# EAGLE design IOB-I2C-MAX731x (EAGLE 7.7.0)
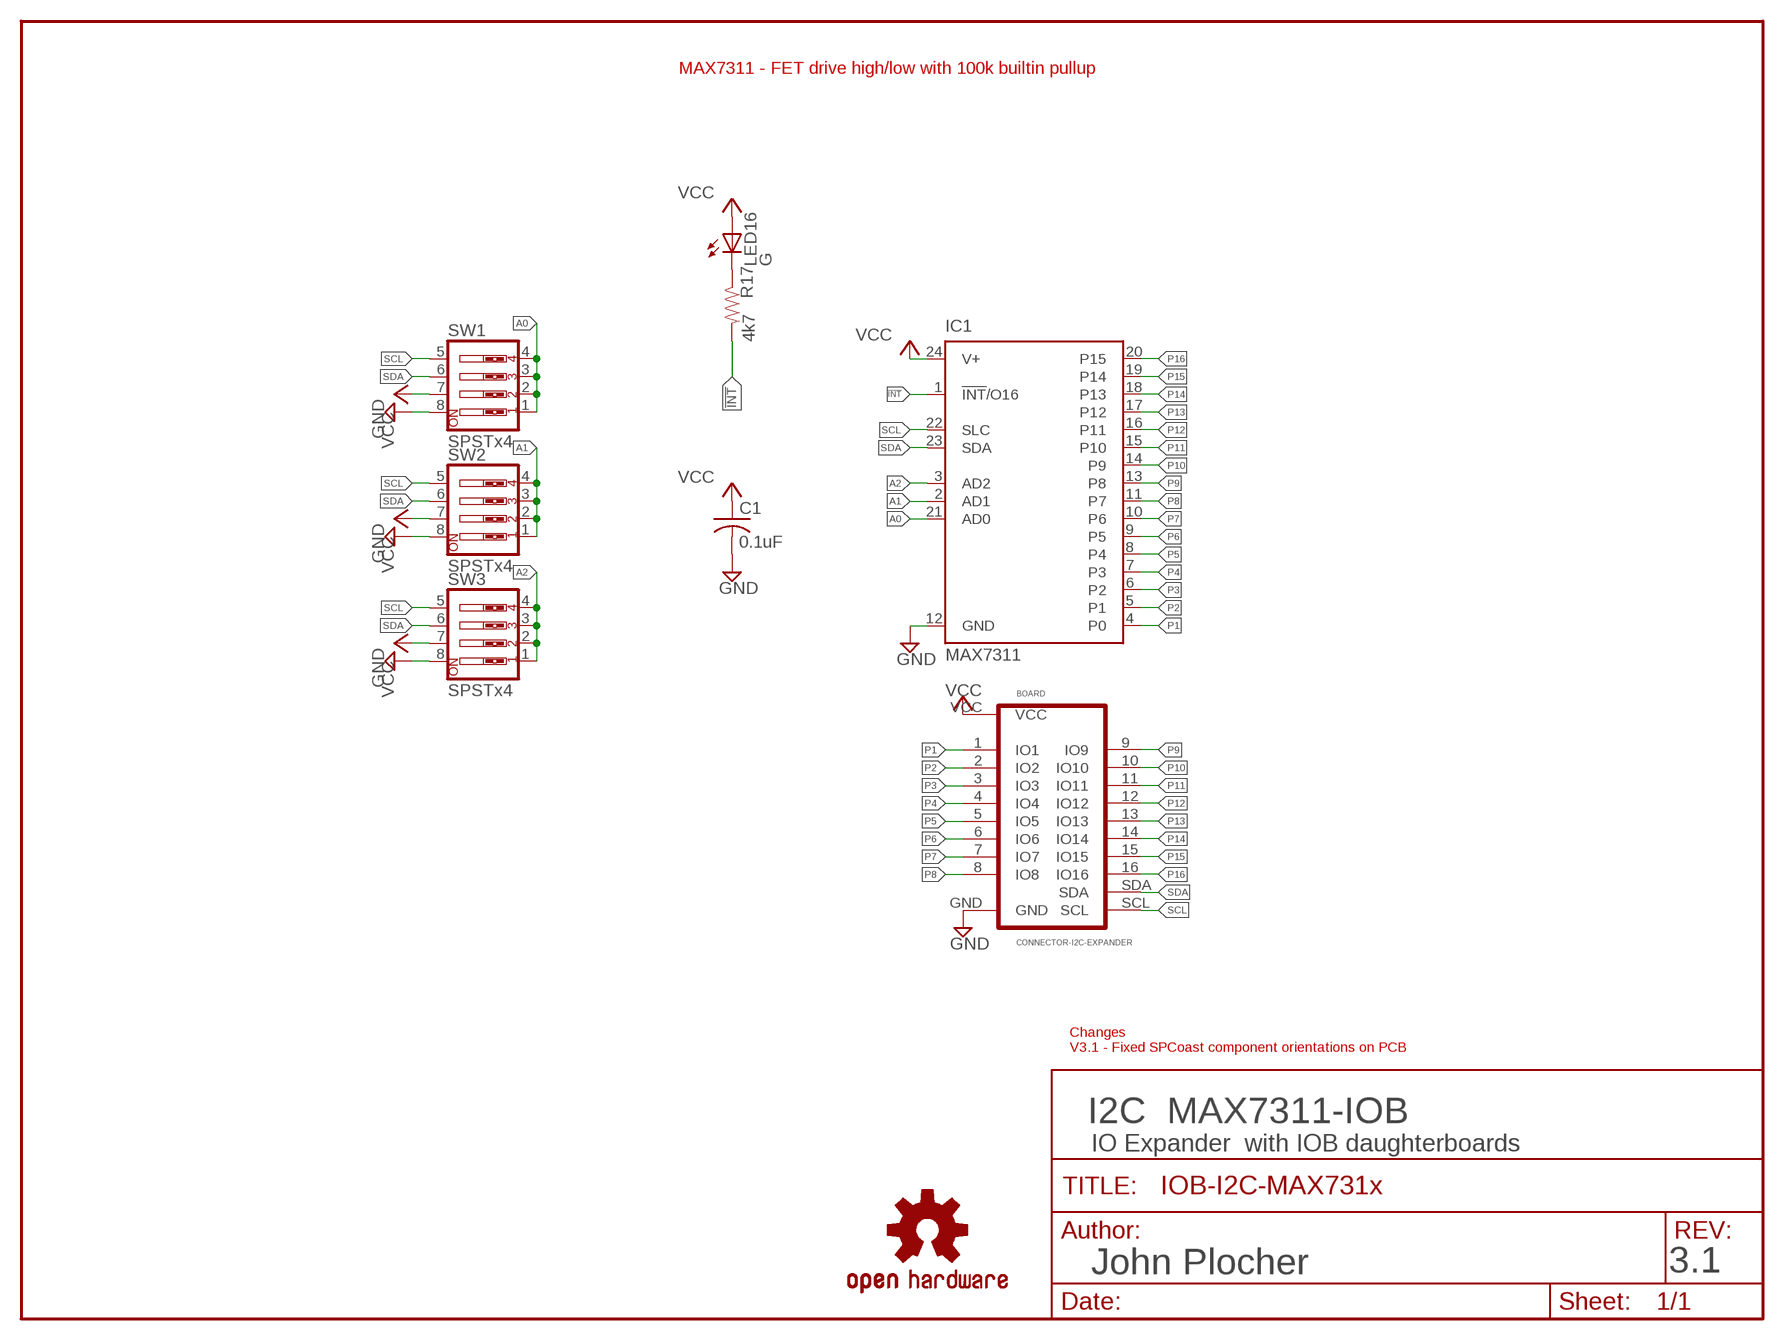
[diagram p0: schematic, sheet 1]

## Parts
BOARD  CONNECTOR-I2C-EXPANDER  [I2C-EXPANDER]
C1  0.1uF  CAP0603  [0603-CAP]
IC1  MAX7311  MAX73XX/AUG  [TSSOP24]
LED16  G  LED0603-LED  [0603-LED]
R17  4k7  R0603-RES  [0603-RES]
SW1  SPSTx4  SW_DIP-4  [EDG-04]
SW2  SPSTx4  SW_DIP-4  [EDG-04]
SW3  SPSTx4  SW_DIP-4  [EDG-04]
U$1  OSHW  DOC-OSHW-LOGO-L  [OSHW-LOGO-L]

## Nets
!INT [signals]: IC1.1(!INT!/O16) R17.2
A0 [signals]: IC1.21(AD0) SW1.1 SW1.2 SW1.3 SW1.4
A1 [signals]: IC1.2(AD1) SW2.1 SW2.2 SW2.3 SW2.4
A2 [signals]: IC1.3(AD2) SW3.1 SW3.2 SW3.3 SW3.4
GND [Power]: BOARD.GND C1.2 IC1.12(GND) SW1.8 SW2.8 SW3.8
N$38: LED16.C R17.1
P1 [signals]: BOARD.1(IO1) IC1.4(P0)
P2 [signals]: BOARD.2(IO2) IC1.5(P1)
P3 [signals]: BOARD.3(IO3) IC1.6(P2)
P4 [signals]: BOARD.4(IO4) IC1.7(P3)
P5 [signals]: BOARD.5(IO5) IC1.8(P4)
P6 [signals]: BOARD.6(IO6) IC1.9(P5)
P7 [signals]: BOARD.7(IO7) IC1.10(P6)
P8 [signals]: BOARD.8(IO8) IC1.11(P7)
P9 [signals]: BOARD.9(IO9) IC1.13(P8)
P10 [signals]: BOARD.10(IO10) IC1.14(P9)
P11 [signals]: BOARD.11(IO11) IC1.15(P10)
P12 [signals]: BOARD.12(IO12) IC1.16(P11)
P13 [signals]: BOARD.13(IO13) IC1.17(P12)
P14 [signals]: BOARD.14(IO14) IC1.18(P13)
P15 [signals]: BOARD.15(IO15) IC1.19(P14)
P16 [signals]: BOARD.16(IO16) IC1.20(P15)
SCL [signals]: BOARD.SCL IC1.22(SLC) SW1.5 SW2.5 SW3.5
SDA [signals]: BOARD.SDA IC1.23(SDA) SW1.6 SW2.6 SW3.6
VCC [Power]: BOARD.VCC C1.1 IC1.24(V+) LED16.A SW1.7 SW2.7 SW3.7

## Notes on the sheet
- MAX7311 - FET drive high/low with 100k builtin pullup
- Changes
  V3.1 - Fixed SPCoast component orientations on PCB
- I2C  MAX7311-IOB
- IO Expander  with IOB daughterboards
- John Plocher | 3.1

## Library data of the parts
BOARD = SPCoast:CONNECTOR-I2C-EXPANDER
C1 = SPCoast:CAP*
IC1 = SPCoast:MAX73XX: 16-Port I/O Expander with LED Intensity Control, Interrupt, and Hot-Insertion Protection
LED16 = SPCoast:LED*
R17 = SPCoast:R*: Resistor Basic schematic elements and footprints for 0603, 1206, and PTH 1/10th watt (small) resistors.
SW1-SW3 = SPCoast:SW_DIP-4: DIP SWITCH
U$1 = SPCoast:DOC-OSHW-LOGO-: Open Source Hardware Logo This logo indicates the piece of hardware it is found on incorporates a OSHW license and/or adheres to the definition of open source hardware http://freedomdefined.org/OSHW Creative Commons - Attribution - ShareAlike 3.0

## Net classes
0 default: width 0.254 mm, drill 0.4 mm, clearance 0.127 mm
1 Power: width 0.254 mm, drill 0.4 mm, clearance 0.127 mm
2 signals: width 0.254 mm, drill 0.4 mm, clearance 0.127 mm

## Board
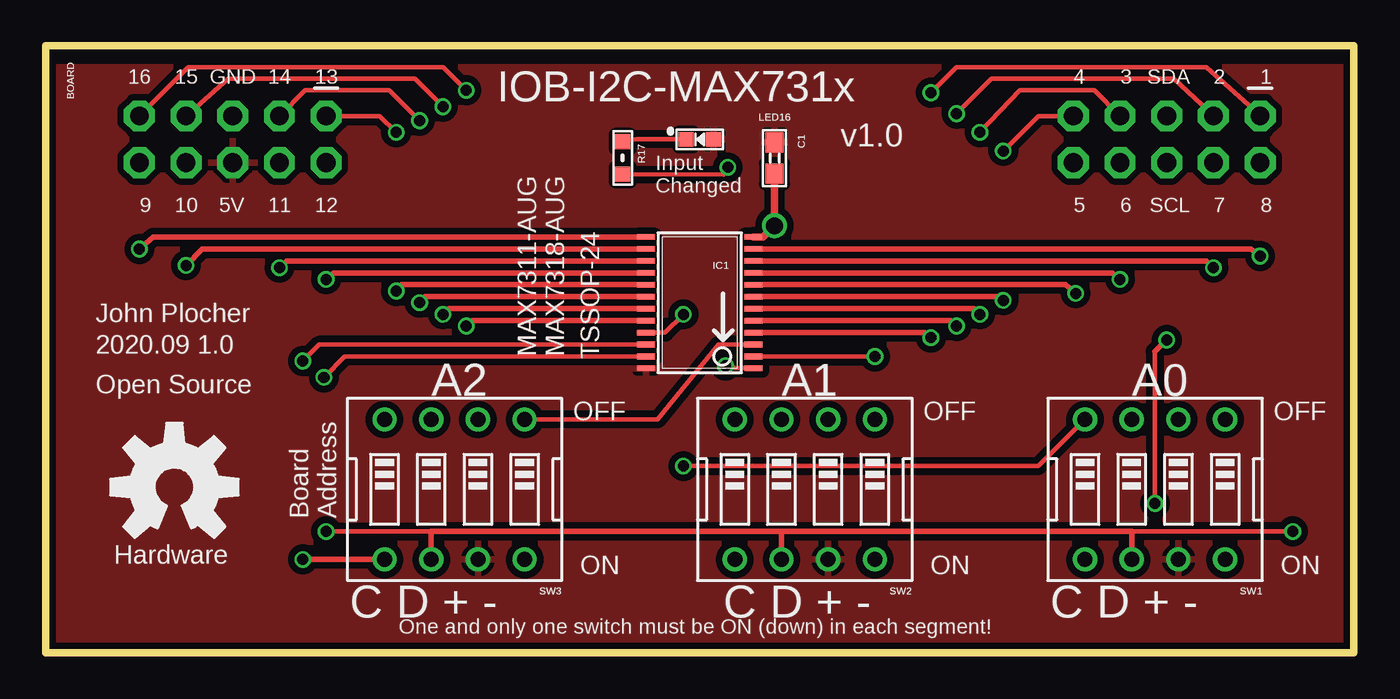
[diagram p1: board, top side]
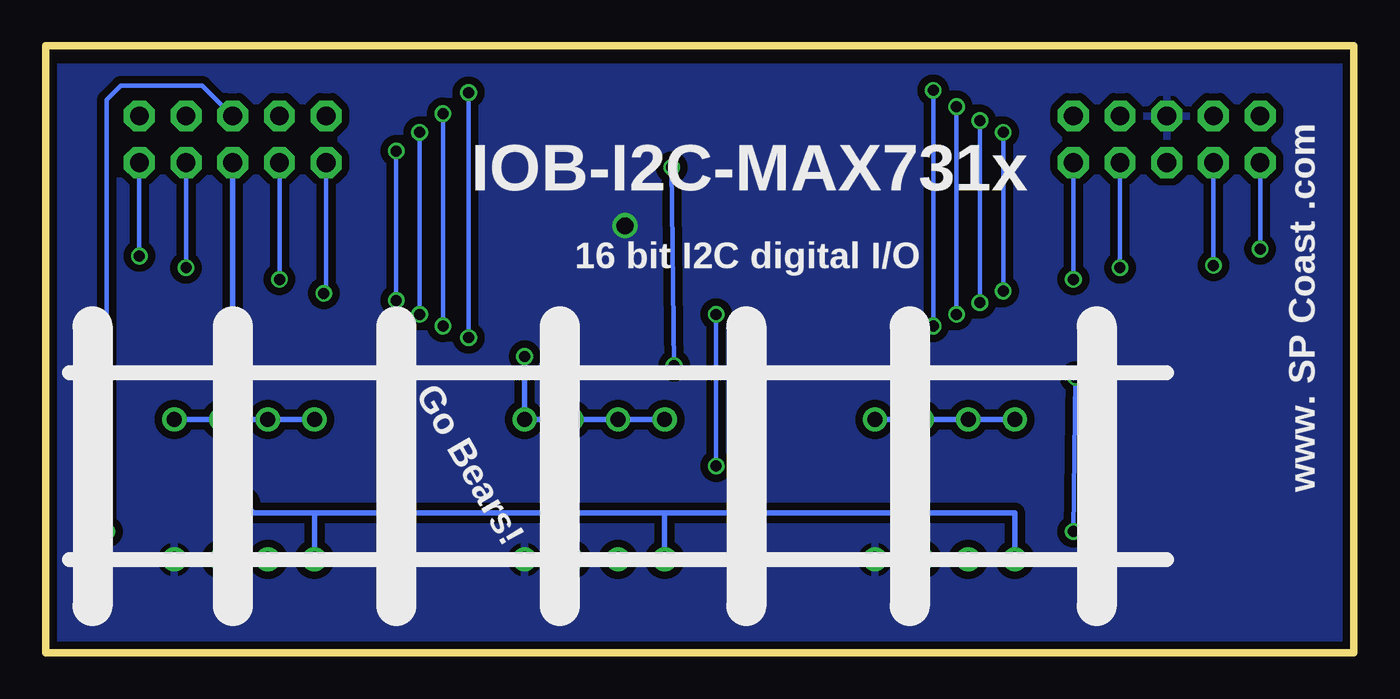
[diagram p2: board, bottom side, seen from below]

Size 71.12 x 33.02 mm. Coordinates in mm from the lower left corner, seen from the top.
Outline: 0,33.02 0,0 71.12,0 71.12,33.02 0,33.02
Copper layers (1*16): Top 0.035mm / dielectric 1.5mm / Bottom 0.035mm
Design rules "Fusion_eagle_rule_v1.1": minimum track width 6mil, minimum drill 12mil, track to track 6mil, track to pad 6mil, pad to pad 6mil, via to via 6mil, smd to smd 0mil, copper to edge 10mil, drill to drill 10mil, minimum pad ring 10mil, minimum via ring 6mil, stop-mask expansion 2mil, vias tented up to drill 100mil, thermal gap 10mil

### Footprints (pad centres in the part's own frame; a part is rotated, then mirrored left to right if it is on the bottom)
I2C-EXPANDER = drill 1.016 pad 1.676 octagon: 1 30.48,1.27; 2 27.94,1.27; 3 22.86,1.27; 4 20.32,1.27; 5 20.32,-1.27; 6 22.86,-1.27; 7 27.94,-1.27; 8 30.48,-1.27; 9 -30.48,-1.27; 10 -27.94,-1.27; 11 -22.86,-1.27; 12 -20.32,-1.27; 13 -20.32,1.27; 14 -22.86,1.27; 15 -27.94,1.27; 16 -30.48,1.27; GND -25.4,1.27; SCL 25.4,-1.27; SDA 25.4,1.27; VCC -25.4,-1.27
0603-CAP = smd 1.1 x 1: 1 -0.85,0; 2 0.85,0
TSSOP24 = smd 0.305 x 0.991: 1 -3.575,-2.918; 2 -2.925,-2.918; 3 -2.275,-2.918; 4 -1.625,-2.918; 5 -0.975,-2.918; 6 -0.325,-2.918; 7 0.325,-2.918; 8 0.975,-2.918; 9 1.625,-2.918; 10 2.275,-2.918; 11 2.925,-2.918; 12 3.575,-2.918; 13 3.575,2.918; 14 2.925,2.918; 15 2.275,2.918; 16 1.625,2.918; 17 0.975,2.918; 18 0.325,2.918; 19 -0.325,2.918; 20 -0.975,2.918; 21 -1.625,2.918; 22 -2.275,2.918; 23 -2.925,2.918; 24 -3.575,2.918
0603-LED = smd 0.8 x 0.8: A 0.75,0; C -0.75,0
0603-RES = smd 0.813 x 0.813: 1 -0.889,0; 2 0.889,0
EDG-04 = drill 0.813: 1 -3.81,-3.81; 2 -1.27,-3.81; 3 1.27,-3.81; 4 3.81,-3.81; 5 3.81,3.81; 6 1.27,3.81; 7 -1.27,3.81; 8 -3.81,3.81

### Placement (x,y rotation side)
BOARD  35.56,27.94 0 top
C1  39.62,26.92 270 top
IC1  35.56,19.05 90 top
LED16  35.56,27.94 0 top
R17  31.37,26.92 270 top
SW1  60.33,8.89 180 top
SW2  41.27,8.89 180 top
SW3  22.23,8.89 180 top
U$1  6.99,9.02 0 top

### Tracks (layer width: path | path; a pad name or v marks a point on that pad's centre or on a via)
!INT  (via drill 0.6)
  Top 0.254: v36.96,15.62 37.34,15.49 38.5,15.49 IC1.1 | R17.2 36.84,26.02 v37.08,26.42
  Bottom 0.254: v37.08,26.42 v36.96,15.62
A0  (via drill 0.6)
  Top 0.254: SW1.4 53.98,10.16 v34.67,10.16 | IC1.21 33.68,17.43 v34.67,18.41
  Bottom 0.254: v34.67,18.41 v34.67,10.16
  Bottom 0.305: SW1.1 SW1.2 SW1.3 SW1.4
A1  (via drill 0.6)
  Top 0.254: IC1.2 44.7,16.12 v45.09,16.12
  Top 0.305: 37.06,12.7 SW2.4
  Bottom 0.305: SW2.4 SW2.3 SW2.2 SW2.1 v45.09,16.12
A2
  Top 0.254: IC1.3 36.59,16.77 33.27,12.7 SW3.1
  Bottom 0.305: SW3.4 SW3.3 SW3.2 SW3.1
GND  (via drill 0.9)
  Top 0.406: IC1.12 39.01,22.62 v39.62,23.24 C1.2
  pour Bottom (isolate 0.406, rank 2): 70.48,0.64 70.48,31.88 0.64,31.88 0.64,0.64
N$38
  Top 0.254: LED16.C 32.12,27.94 R17.1
P1  (via drill 0.6)
  Top 0.254: v48.13,30.48 49.53,31.88 63.12,31.88 65.66,29.59 BOARD.1
  Top 0.305: IC1.4 47.78,17.43 v48.13,17.14
  Bottom 0.254: v48.13,17.14 v48.13,30.48
P2  (via drill 0.6)
  Top 0.254: v49.53,29.34 51.44,31.24 61.34,31.24 63.25,29.46 BOARD.2
  Top 0.305: IC1.5 49.19,18.07 v49.53,17.78
  Bottom 0.254: v49.53,17.78 v49.53,29.34
P3  (via drill 0.6)
  Top 0.254: v50.8,28.32 52.96,30.61 57.02,30.61 BOARD.3
  Top 0.305: IC1.6 50.48,18.73 v50.8,18.41
  Bottom 0.254: v50.8,18.41 v50.8,28.32
P4  (via drill 0.6)
  Top 0.254: BOARD.4 53.98,29.21 v52.07,27.3
  Top 0.305: IC1.7 51.76,19.38 v52.07,19.18
  Bottom 0.254: v52.07,27.3 v52.07,19.18
P5  (via drill 0.6)
  Top 0.305: IC1.8 55.46,20.02 v56.01,19.56
  Bottom 0.254: BOARD.5 55.88,19.56 v56.01,19.56
P6  (via drill 0.6)
  Top 0.305: IC1.9 58.01,20.68 v58.42,20.32
  Bottom 0.254: BOARD.6 v58.42,20.32
P7  (via drill 0.6)
  Top 0.305: IC1.10 63.11,21.32 v63.5,20.95
  Bottom 0.254: BOARD.7 v63.5,20.95
P8  (via drill 0.6)
  Top 0.305: IC1.11 65.54,21.98 v66.04,21.59
  Bottom 0.254: BOARD.8 v66.04,21.59
P9  (via drill 0.6)
  Top 0.305: v5.08,21.97 5.82,22.62 IC1.13
  Bottom 0.254: BOARD.9 v5.08,21.97
P10  (via drill 0.6)
  Top 0.305: v7.62,21.08 8.51,21.97 IC1.14
  Bottom 0.254: BOARD.10 v7.62,21.08
P11  (via drill 0.6)
  Top 0.305: IC1.15 13.09,21.32 v12.7,20.95
  Bottom 0.254: BOARD.11 v12.7,20.95
P12  (via drill 0.6)
  Top 0.305: IC1.16 15.65,20.68 v15.24,20.32
  Bottom 0.254: BOARD.12 v15.24,20.32
P13  (via drill 0.6)
  Top 0.254: BOARD.13 18.16,29.21 v19.05,28.32
  Top 0.305: IC1.17 19.34,20.02 v19.05,19.68
  Bottom 0.254: v19.05,28.32 v19.05,19.68
P14  (via drill 0.6)
  Top 0.254: BOARD.14 14.1,30.61 18.67,30.61 v20.32,28.96
  Top 0.305: IC1.18 20.63,19.38 v20.32,19.05
  Bottom 0.254: v20.32,28.96 v20.32,19.05
P15  (via drill 0.6)
  Top 0.254: BOARD.15 9.91,31.24 20.07,31.24 v21.59,29.72
  Top 0.305: IC1.19 21.91,18.73 v21.59,18.41
  Bottom 0.254: v21.59,29.72 v21.59,18.41
P16  (via drill 0.6)
  Top 0.254: BOARD.16 7.75,31.88 21.59,31.88 v22.86,30.61
  Top 0.305: IC1.20 23.2,18.07 v22.86,17.78
  Bottom 0.254: v22.86,30.61 v22.86,17.78
SCL  (via drill 0.6)
  Top 0.254: IC1.22 14.87,16.77 v13.97,15.88 | 60.33,16.38 v60.33,8.13
  Top 0.305: v13.97,5.08 SW3.5 | v60.96,17.02 60.33,16.38
  Bottom 0.254: 56.64,7.62 56.52,7.49
  Bottom 0.305: SW3.5 18.41,7.62 37.47,7.62 | 37.47,7.62 SW2.5 | 37.47,7.62 56.52,7.62 56.52,7.49 SW1.5 | v13.97,15.88 v13.97,5.08 | BOARD.SCL v60.96,17.02 | v60.33,8.13 59.82,7.62 56.64,7.62
SDA  (via drill 0.6)
  Top 0.254: IC1.23 16.26,16.13 v15.12,14.99 | v15.24,6.6 20.95,6.6 | v67.82,6.6 59.05,6.6
  Top 0.305: SW3.6 20.95,6.6 40.01,6.6 | 40.01,6.6 SW2.6 | SW1.6 59.05,6.6 40.01,6.6
  Bottom 0.254: v15.12,14.99 v15.24,6.6 | BOARD.SDA 62.61,30.86 67.06,30.86 67.82,30.1 v67.82,6.6
VCC
  pour Top (isolate 0.356, rank 2): 70.48,0.64 70.48,31.88 0.64,31.88 0.64,0.64

### Text on the board
tPlace: IOB-I2C-MAX731x | v1.0 | Input / Changed | John Plocher | 2020.09 1.0 | MAX7311-AUG / MAX7318-AUG | TSSOP-24 | Open Source | A2 | A1 | A0 | OFF | OFF | OFF | Board / Address | Hardware | ON | ON | ON | C D + - | C D + - | C D + - | One and only one switch must be ON (down) in each segment!
bPlace: www. SP Coast .com | 16 bit I2C digital I/O | Go Bears!
_tNames: BOARD | LED16 | R17 | C1 | IC1 | SW3 | SW2 | SW1